# EAGLE design gtfo_shoo (EAGLE 9.6.2)
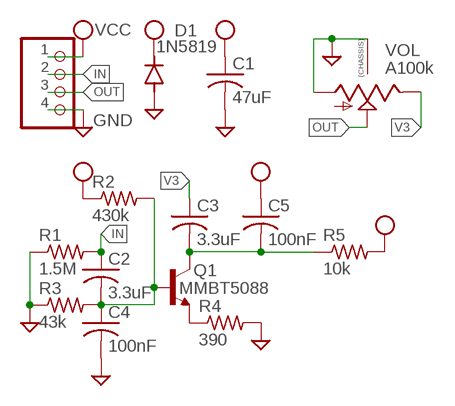
[diagram p0: schematic, sheet 1]

## Parts
C1  47uF  C-USC1210  [C1210]
C2  3.3uF  C-USC0805  [C0805]
C3  3.3uF  C-USC0805  [C0805]
C4  100nF  C-USC0603  [C0603]
C5  100nF  C-USC0603  [C0603]
D1  1N5819  DIODE-SOD123  [SOD123]
JP1  PINHD-1X4  [1X04]
Q1  MMBT5088  [SOT23-BEC]
R1  1.5M  R-US_R0603  [R0603]
R2  430k  R-US_R0603  [R0603]
R3  43k  R-US_R0603  [R0603]
R4  390  R-US_R0603  [R0603]
R5  10k  R-US_R0603  [R0603]
VOL  A100k  9MM_SNAP-IN_POT_CHASSIS  [9MM_SNAP-IN_POT]

## Nets
GND: C1.2 C4.2 D1.A JP1.4 R1.1 R3.1 R4.2 VOL.1(A) VOL.CHASSIS1 VOL.CHASSIS2
IN: C2.1 JP1.2 R1.2
N$2: C2.2 C4.1 Q1.B R2.2 R3.2
N$3: C3.2 C5.2 Q1.C R5.1
N$4: Q1.E R4.1
OUT: JP1.3 VOL.2(S)
V3: C3.1 VOL.3(E)
VCC: C1.1 C5.1 D1.C JP1.1 R2.1 R5.2

## Library data of the parts
C1-C5 = adafruit:C-US: CAPACITOR, American symbol
D1 = diode:DIODE-: DIODE
JP1 = Connector:PINHD-1X4: PIN HEADER; CATEGORY: CONNECTOR; SUB-CATEGORY: PIN-HEADER
Q1 = MMBT5088_:MMBT5088*: NPN TRANSISTOR Check prices <https://pricing.snapeda.com/search/part/MMBT5088/?ref=eda>; AVAILABILITY: Good; DESCRIPTION: Bipolar (BJT) Transistor NPN 30V 100mA 50MHz 350mW Surface Mount SOT-23; MF: ON Semiconductor; MP: MMBT5088; PACKAGE: SOT-23-3 Fairchild Semiconductor; PRICE: None; PURCHASE-URL: https://pricing.snapeda.com/search/part/MMBT5088/?ref=eda
R1-R5 = adafruit:R-US_: RESISTOR, American symbol
VOL = MusicThingModular:9MM_SNAP-IN_POT_CHASSIS: 9mm vertical snap-in pot, Alpha / Panasonic style, with a connection to the metal chassis for grounding

## Board
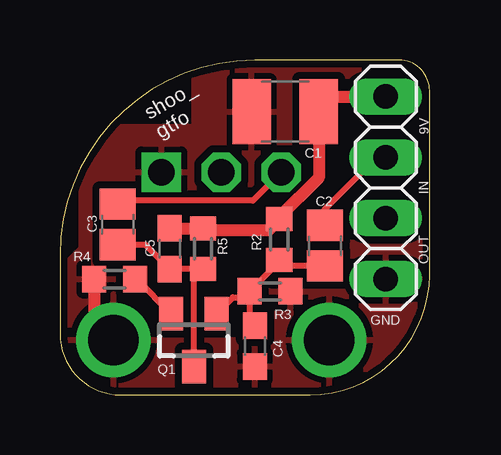
[diagram p1: board, top side]
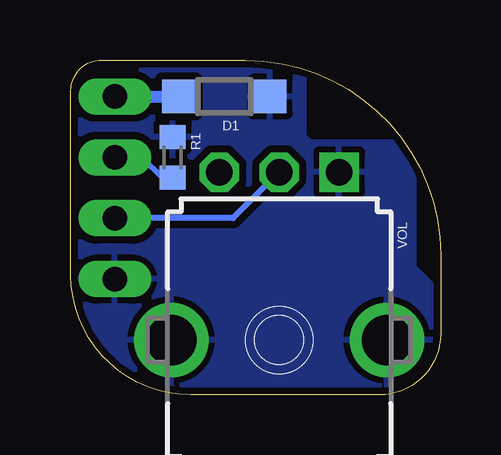
[diagram p2: board, bottom side, seen from below]

Size 15.42 x 13.96 mm. Coordinates in mm from the lower left corner, seen from the top.
Outline: 14.15,13.96 8.13,13.96 arc90 0,5.83 0,2.54 arc90 2.54,0 10.42,0 arc90 15.42,5 15.42,12.69 arc90 14.15,13.96
Copper layers (1*16): Top 0.035mm / dielectric 1.5mm / Bottom 0.035mm
Design rules "default *": minimum track width 6mil, minimum drill 0.35mm, track to track 6mil, track to pad 6mil, pad to pad 6mil, via to via 6mil, smd to smd 6mil, copper to edge 10mil, drill to drill 6mil, minimum pad ring 10mil, minimum via ring 8mil, stop-mask expansion 4mil, vias tented up to drill 0mil, thermal gap 10mil

### Footprints (pad centres in the part's own frame; a part is rotated, then mirrored left to right if it is on the bottom)
C1210 = smd 1.6 x 2.7: 1 -1.4,0; 2 1.4,0
C0805 = smd 1.3 x 1.5: 1 -0.85,0; 2 0.85,0
C0603 = smd 1.1 x 1: 1 -0.85,0; 2 0.85,0
SOD123 = smd 1.4 x 1.4: A 1.9,0; C -1.9,0
1X04 = drill 1.016 long: 1 -3.81,0; 2 -1.27,0; 3 1.27,0; 4 3.81,0
SOT23-BEC = smd 1 x 1.4: B -0.95,-1.1; C 0,1.1; E 0.95,-1.1
R0603 = smd 1 x 1.1: 1 -0.85,0; 2 0.85,0
9MM_SNAP-IN_POT = drill 1.1 square: 1 -2.5,-7 | drill 1.1 octagon: 2 0,-7; 3 2.5,-7 | drill 2.1 pad 2.794: CHASSIS1 -4.5,0; CHASSIS2 4.5,0

### Placement (x,y rotation side)
C1  9.4,11.81 180 top
C2  11.05,6.22 270 top
C3  2.41,7.11 270 top
C4  8.13,2.03 270 top
C5  4.57,6.1 270 top
D1  9.02,12.45 0 bottom
JP1  13.59,8.64 270 top
Q1  5.59,2.29 180 top
R1  11.18,9.91 270 bottom
R2  9.14,6.48 270 top
R3  8.76,4.32 180 top
R4  2.29,4.83 180 top
R5  5.97,6.1 90 top
VOL  6.73,2.29 180 bottom

### Tracks (layer width: path | path; a pad name or v marks a point on that pad's centre or on a via)
GND
  Top 0.508: R4.2 1.44,3.08 VOL.CHASSIS1
  pour Bottom (isolate 0.305): 1.52,-1.27 16.51,-1.27 16.51,15.24 7.62,15.24 5.71,13.34 5.71,10.79 5.46,10.54 1.14,10.54 1.14,5.33 -1.27,2.92 -1.27,-1.4 1.52,-1.27
  pour Top (isolate 0.305): -1.27,-1.27 16.51,-1.27 16.51,13.97 15.24,15.24 7.62,15.24 5.59,13.21 5.59,11.18 0.89,11.18 0.89,6.1 -1.27,3.94
IN
  Top 0.254: C2.1 11.05,7.75 13.21,9.91 JP1.2
  Bottom 0.254: R1.2 11.6,9.06 12.45,9.91 JP1.2
N$2
  Top 0.254: 7.91,4.06 R3.2 9.14,5.55 R2.2 9.4,5.37 C2.2 | 7.91,4.06 7.91,3.1 C4.1 | Q1.B 7.22,4.06 7.91,4.06
N$3
  Top 0.254: Q1.C 5.59,4.87 | 5.59,4.87 5.59,5.25 C5.2 3.56,6.26 C3.2 | 5.59,4.87 R5.1
N$4
  Top 0.254: Q1.E 3.2,4.83 R4.1
OUT
  Bottom 0.254: VOL.2 8.65,7.37 JP1.3
V3
  Top 0.254: VOL.3 8.05,8.1 2.56,8.1 C3.1
VCC
  Top 0.508: C5.1 R5.2 6.06,6.86 8.68,6.86 R2.1 9.14,7.4 10.8,9.05 C1.1 11.43,12.45 JP1.1
  Bottom 0.508: JP1.1 D1.C

### Text on the board
tPlace: 9V | shoo_ / gtfo | IN | OUT | GND